# Altium schematic sheet [08]GPS.SchDoc
size A4
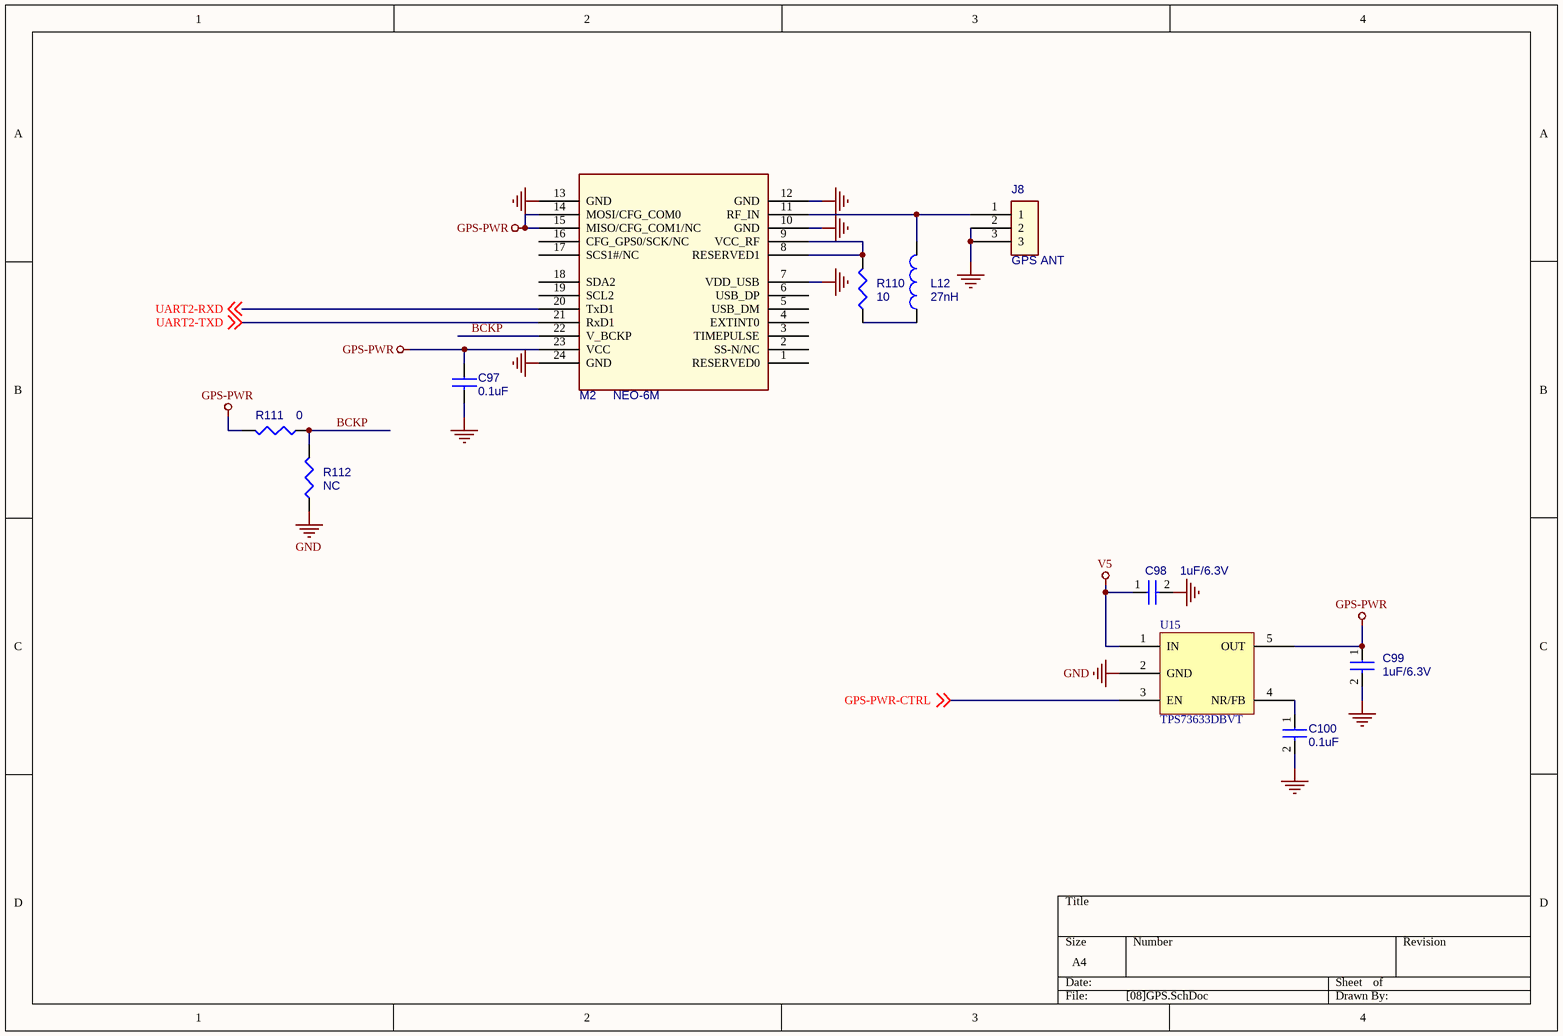
[diagram p0: [08]GPS.SchDoc]

## Parts
C97  0.1uF  [0603]
C98  1uF/6.3V  [0603]
C99  1uF/6.3V  [0603]
C100  0.1uF  [0603]
J8  GPS ANT  [ANT]
L12  27nH  [0603]
M2  NEO-6M  [NEO-6]
R110  10  [0603]
R111  0  [0603]
R112  NC  [0603]
U15  TPS73633DBVT  [SOT23-5]

## Nets
GND: C97.2 C98.2 C99.2 C100.2 J8.2 J8.3 M2.7(VDD_USB) M2.10(GND) M2.12(GND) M2.13(GND) M2.24(GND) R112.1 U15.2(GND)
GPS-PWR: C97.1 C99.1 M2.14(MOSI/CFG_COM0) M2.15(MISO/CFG_COM1/NC) M2.23(VCC) R111.2 U15.5(OUT)
V5: C98.1 U15.1(IN)
BCKP: M2.22(V_BCKP) R111.1 R112.2
GPS-PWR-CTRL: U15.3(EN) ; off-sheet GPS-PWR-CTRL
UART2-RXD: M2.20(TxD1) ; off-sheet UART2-RXD
UART2-TXD: M2.21(RxD1) ; off-sheet UART2-TXD
NetC100_1: C100.1 U15.4(NR/FB)
NetJ8_1: J8.1 L12.2 M2.11(RF_IN)
NetL12_1: L12.1 R110.1
NetM2_8: M2.8(RESERVED1) M2.9(VCC_RF) R110.2

Not connected (* = marked no-connect by the designer): M2 1(RESERVED0) 2(SS-N/NC) 3(TIMEPULSE) 4(EXTINT0) 5(USB_DM) 6(USB_DP) 16(CFG_GPS0/SCK/NC) 17(SCS1#/NC) 18(SDA2) 19(SCL2)

## Library data of the parts
C97 = P_CAP NP
C98-C100 = CAP NP_Dup2
J8 = HRS_U_0.FL-R-SMT-10
L12 = 2.2UH_LPS3015-222MLC_1.5A_20%~D
M2 = NEO-5M
R110-R112 = P_R